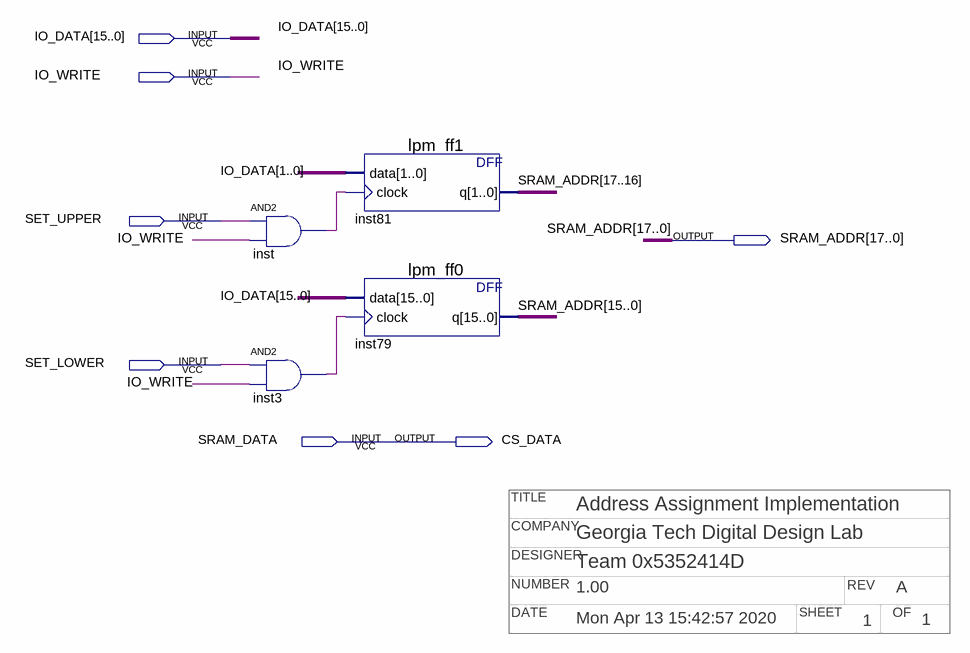
[diagram p0: schematic sheet]
// Quartus schematic AddressImplementation.bdf as structural Verilog: 4 symbols, 7 pins
// Title block: TITLE: Address Assignment Implementation; COMPANY: Georgia Tech Digital Design Lab; DESIGNER: Team 0x5352414D; NUMBER: 1.00; REV: A; DATE: Mon Apr 13 15:42:57 2020; SHEET: 1; OF: 1
module AddressImplementation (
  input  [15:0] IO_DATA,
  input  IO_WRITE,
  input  SET_UPPER,
  input  SET_LOWER,
  input  SRAM_DATA,
  output [17:0] SRAM_ADDR,
  output CS_DATA
);

  wire inst3_out, inst_out;

  and inst (inst_out, SET_UPPER, IO_WRITE);
  and inst3 (inst3_out, SET_LOWER, IO_WRITE);
  lpm_ff1 inst81 (.data(IO_DATA[1:0]), .clock(inst_out), .q(SRAM_ADDR[17:16]));
  lpm_ff0 inst79 (.data(IO_DATA), .clock(inst3_out), .q(SRAM_ADDR[15:0]));

  assign CS_DATA = SRAM_DATA;
endmodule
